# Altium project PCB_Project1.PrjPCB
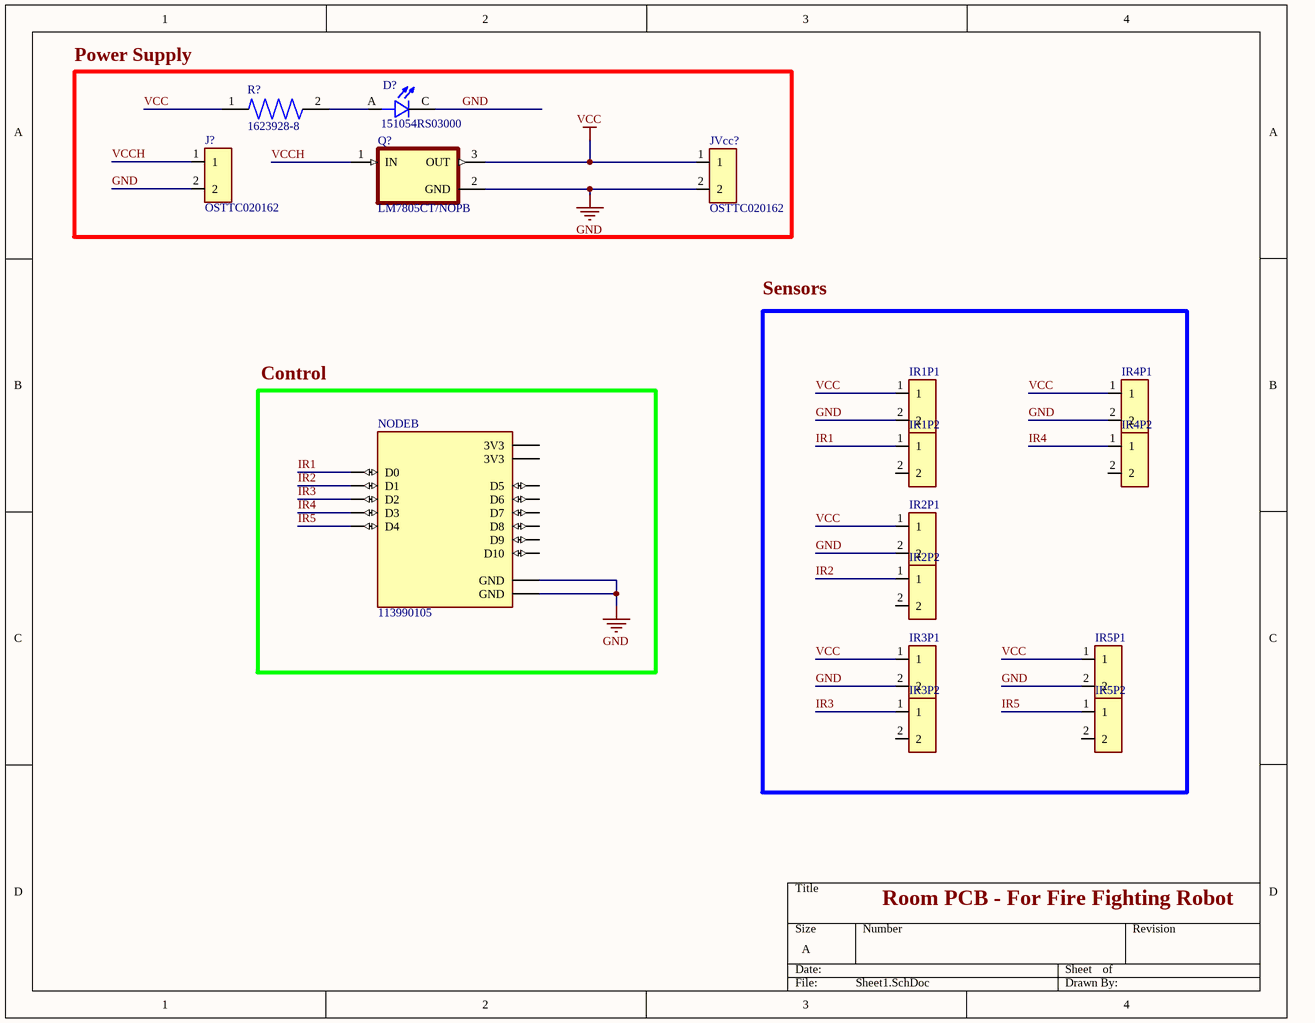
[diagram p0: Sheet1.SchDoc]
1 sheet, 16 parts. Net scope: global (net labels, ports and power ports of the same name join across sheets).
Board file: PCB1.PcbDoc

## Sheet Sheet1.SchDoc
size A

### Parts
D?  151054RS03000  [LED_151054RS03000]
IR1P1  (no value)  [OST_OSTTC020162]
IR1P2  (no value)  [OST_OSTTC020162]
IR2P1  (no value)  [OST_OSTTC020162]
IR2P2  (no value)  [OST_OSTTC020162]
IR3P1  (no value)  [OST_OSTTC020162]
IR3P2  (no value)  [OST_OSTTC020162]
IR4P1  (no value)  [OST_OSTTC020162]
IR4P2  (no value)  [OST_OSTTC020162]
IR5P1  (no value)  [OST_OSTTC020162]
IR5P2  (no value)  [OST_OSTTC020162]
J?  OSTTC020162  [OST_OSTTC020162]
JVcc?  OSTTC020162  [OST_OSTTC020162]
NODE  113990105  [SEEED_113990105]  (part B of 2)
Q?  LM7805CT/NOPB  [TO254P1054X470X2600-3]
R?  1623928-8  [RESAD700W45L350D185]

### Blocks framed on the sheet
Power Supply: D? J? JVcc? Q? R?
Sensors: IR1P1 IR1P2 IR2P1 IR2P2 IR3P1 IR3P2 IR4P1 IR4P2 IR5P1 IR5P2
Control: NODE

### Nets
GND: D?.C IR1P1.2 IR2P1.2 IR3P1.2 IR4P1.2 IR5P1.2 J?.2 JVcc?.2 NODE.J2_7(GND) NODE.J2_14(GND) Q?.2(GND)
VCC: IR1P1.1 IR2P1.1 IR3P1.1 IR4P1.1 IR5P1.1 JVcc?.1 Q?.3(OUT) R?.1
IR1: IR1P2.1 NODE.J2_1(D0)
IR2: IR2P2.1 NODE.J2_2(D1)
IR3: IR3P2.1 NODE.J2_3(D2)
IR4: IR4P2.1 NODE.J2_4(D3)
IR5: IR5P2.1 NODE.J2_5(D4)
VCCH: J?.1 Q?.1(IN)
NetD?_A: D?.A R?.2

Not connected (* = marked no-connect by the designer): IR1P2 2; IR2P2 2; IR3P2 2; IR4P2 2; IR5P2 2; NODE J2_6(3V3) J2_8(D5) J2_9(D6) J2_10(D7) J2_11(D8) J2_12(D9) J2_13(D10) J2_15(3V3)

### Notes on the sheet
- Room PCB - For Fire Fighting Robot

### Library data of the parts
D? = 151054RS03000: Red 623nm LED Indication - Discrete 1.9V Radial; MF: {'manufacturer': u'Wurth Elektronik'}; Availability: Unavailable; Price: None; MP: 151054RS03000; Package: None; Value: *
IR1P1 IR1P2 IR2P1 IR2P2 IR3P1 IR3P2 IR4P1 IR4P2 IR5P1 IR5P2 J? JVcc? = OSTTC020162: CONN, TERMINAL BLOCK, 5mm, 2 PIN, .42"L x.30"D x .39"H; MF: {'manufacturer': u'On Shore'}; Price: None; MP: OSTTC020162; Package: None; Availability: Unavailable; Value: *
NODE = 113990105: NodeMCU v2 - Lua based ESP8266 development kit; MF: {'manufacturer': u'Seeed Technology'}; Price: None; Value: *; Package: None; Availability: Unavailable; MP: 113990105
Q? = LM7805CT/NOPB: Standard Regulator Pos 5V 1A 3-Pin(3+Tab) TO-220 Rail; MF: {'manufacturer': u'ON Semiconductor'}; MP: LM7805CT/NOPB; Value: *; Package: None; Price: None; Availability: Unavailable
R? = 1623928-8: CFR16 5% 10K; MF: {'manufacturer': u'TE Connectivity'}; Availability: Unavailable; Price: None; MP: 1623928-8; Package: None; Value: *